# EAGLE design V2_CapTouch4Pad_ad (EAGLE 9.6.2)
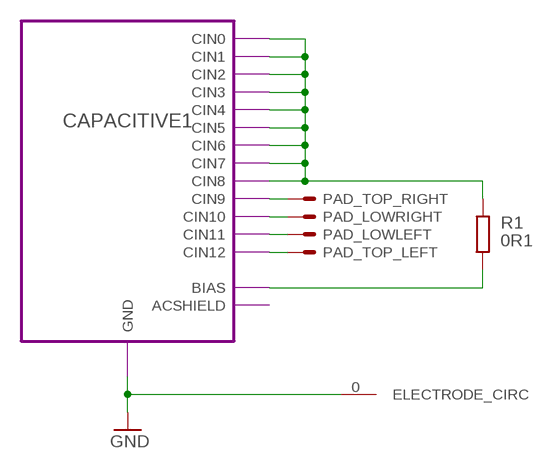
[diagram p0: schematic, sheet 1]

## Parts
PAD_LOWLEFT  TS_ELECTRODE-SLICE-BACKUP2  [TS_ELECTRODE-SLICE]
PAD_LOWRIGHT  TS_ELECTRODE-SLICE-BACKUP2  [TS_ELECTRODE-SLICE]
PAD_TOP_LEFT  TS_ELECTRODE-SLICE-BACKUP2  [TS_ELECTRODE-SLICE]
PAD_TOP_RIGHT  TS_ELECTRODE-SLICE-BACKUP2  [TS_ELECTRODE-SLICE]
R1  RL1206FR-7W0R1L  [R1206]
U$5  TS_ELECTRODE_CIRC  [TS_ELECTRODE_CIRC]

## Module instances
CAPACITIVE1 = CAPACITIVE

## Nets
GND: U$5.0(ELECTRODE_CIRC) ; port CAPACITIVE1.GND
N$1: PAD_TOP_RIGHT.PAD$1(S) ; port CAPACITIVE1.CIN9
N$2: PAD_LOWRIGHT.PAD$1(S) ; port CAPACITIVE1.CIN10
N$3: PAD_LOWLEFT.PAD$1(S) ; port CAPACITIVE1.CIN11
N$4: PAD_TOP_LEFT.PAD$1(S) ; port CAPACITIVE1.CIN12
N$5: R1.2 ; port CAPACITIVE1.CIN8 CAPACITIVE1.CIN0 CAPACITIVE1.CIN7 CAPACITIVE1.CIN6 CAPACITIVE1.CIN5 CAPACITIVE1.CIN4 CAPACITIVE1.CIN3 CAPACITIVE1.CIN2 CAPACITIVE1.CIN1
N$6: R1.1 ; port CAPACITIVE1.BIAS

## Library data of the parts
PAD_LOWLEFT PAD_LOWRIGHT PAD_TOP_LEFT PAD_TOP_RIGHT = msrm:TS_ELECTRODE-SLICE-BACKUP2
R1 = msrm:RL?FR-7W*L: SMD RESISTOR RES 0.1 OHM 1% 1/2W 1206 package: 1206 : 0.1 Ohm ___ Source: Digikey <https://www.digikey.de/products/en?keywords=311-0.1LYCT-ND> ; Datasheet <http://www.yageo.com/documents/recent/PYu-RT_1-to-0.01_RoHS_L_11.pdf>; DIGIKEY: 311-0.1LYCT-ND; RVALUE: 0R1; SPICEPREFIX: R
U$5 = msrm:TS_ELECTRODE_CIRC

## Module CAPACITIVE
Ports: ACSHIELD(pas) GND(pwr) CIN0(in) CIN1(in) CIN2(in) CIN3(in) CIN4(in) CIN5(in) CIN6(in) CIN7(in) CIN8(in) CIN9(in) CIN10(in) CIN11(in) CIN12(in) BIAS(pas)
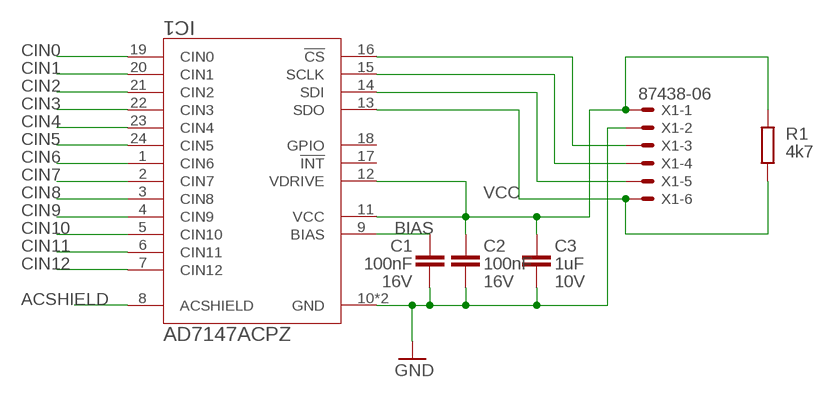
[diagram p1: schematic, module CAPACITIVE, sheet 1]

### Parts
C1  GCM155R71C104JA55  [C0402]
C2  GCM155R71C104JA55  [C0402]
C3  GCM155C7  GCM155C71A105KE38D  [C0402]
IC1  AD7147ACPZ  [CP_24_3_ADI-M]
R1  RT0402FRE074K7L  [R0402]
X1  87438-06  [87438-06]

### Nets
ACSHIELD: IC1.8(ACSHIELD)
BIAS: C1.1 IC1.9(BIAS)
CIN0: IC1.19(CIN0)
CIN1: IC1.20(CIN1)
CIN2: IC1.21(CIN2)
CIN3: IC1.22(CIN3)
CIN4: IC1.23(CIN4)
CIN5: IC1.24(CIN5)
CIN6: IC1.1(CIN6)
CIN7: IC1.2(CIN7)
CIN8: IC1.3(CIN8)
CIN9: IC1.4(CIN9)
CIN10: IC1.5(CIN10)
CIN11: IC1.6(CIN11)
CIN12: IC1.7(CIN12)
GND: C1.2 C2.2 C3.2 IC1.10(GND) IC1.HTAB(GND) X1.2
N$1: IC1.13(SDO) R1.1 X1.6
N$8: IC1.16(!CS) X1.3
N$9: IC1.15(SCLK) X1.4
N$10: IC1.14(SDI) X1.5
VCC: C2.1 C3.1 IC1.11(VCC) IC1.12(VDRIVE) R1.2 X1.1
Unconnected: IC1.17(!INT) IC1.18(GPIO)

### Library data of the parts
C1 C2 = msrm:GCM?R7*: Multilayer Ceramic Capacitors Chip Multilayer Ceramic Capacitors for Automotive –55 to 125°C Sources: Catalogue <https://www.murata.com/~/media/webrenewal/support/library/catalog/products/capacitor/mlcc/c03e.ashx?la=en-us> Part Numbering <https://search.murata.co.jp/Ceramy/image/img/A01X/partnumbering_e_02.pdf> package: C0201 : 470pF ___ Source: Digikey <https://www.digikey.de/products/en?keywords=490-17744-1-ND> ; Datasheet <https://search.murata.co.jp/Ceramy/image/img/A01X/G101/ENG/GCM033R71E471KA03-01.pdf> package: C0402 : 100nF ___ Source: Digikey <https://www.digikey.de/products/en?keywords=490-16433-1-ND> ; Datasheet <https://search.murata.co.jp/Ceramy/image/img/A01X/G101/ENG/GCM155R71C104JA55-01.pdf> 220nF ___ Source: Digikey <https://www.digikey.de/products/en?keywords=490-10671-1-ND> ; Datasheet <https://www.murata.com/-/media/webrenewal/support/library/catalog/products/capacitor/ceramiccapacitor/c03e.ashx?la=en-us&cvid=20200707014404000000> 6.8nF ___ Source: Digikey <https://www.digikey.de/products/en?keywords=490-12655-1-ND> ; Datasheet <https://search.murata.co.jp/Ceramy/image/img/A01X/G101/ENG/GCM155R71C683KA55-01.pdf> 10nF ___ Source: Digikey <https://www.digikey.de/products/en?keywords=490-6043-1-ND> ; Datasheet <https://search.murata.co.jp/Ceramy/image/img/A01X/G101/ENG/GCM155R71E103KA37-01.pdf> 22nF ___ Source: Digikey <https://www.digikey.de/products/en?keywords=490-6044-1-ND> ; Datasheet <https://search.murata.co.jp/Ceramy/image/img/A01X/G101/ENG/GCM155R71E223KA55-01.pdf> 470pF ___ Source: Digikey <https://www.digikey.de/products/en?keywords=490-4913-1-ND> ; Datasheet <https://search.murata.co.jp/Ceramy/image/img/A01X/G101/ENG/GCM155R71H471KA37-01.pdf> package: C0603 : 1µF ___ Source: Digikey <https://www.digikey.de/products/en?keywords=490-5241-1-ND> ; Datasheet <https://www.murata.com/-/media/webrenewal/support/library/catalog/products/capacitor/ceramiccapacitor/c03e.ashx?la=en-us&cvid=20200707014404000000> 470nF ___ Source: Digikey <https://www.digikey.de/products/en?keywords=490-12589-1-ND> ; Datasheet <https://search.murata.co.jp/Ceramy/image/img/A01X/G101/ENG/GCM188R71C474KA55-01.pdf> 10nF ___ Source: Digikey <https://www.digikey.de/products/en?keywords=490-4781-1-ND> ; Datasheet <https://search.murata.co.jp/Ceramy/image/img/A01X/G101/ENG/GCM188R72A103KA37-01.pdf> 22nF ___ Source: Digikey <https://www.digikey.de/products/en?keywords=490-4782-1-ND> ; Datasheet <https://www.murata.com/-/media/webrenewal/support/library/catalog/products/capacitor/ceramiccapacitor/c03e.ashx?la=en-us&cvid=20200707014404000000> package: C0805 : 10µF ___ Source: Digikey <https://www.digikey.de/products/en?keywords=490-14361-1-ND> ; Datasheet <https://search.murata.co.jp/Ceramy/image/img/A01X/G101/ENG/GCM21BR70J106KE22-01.pdf> 2.2µF ___ Source: Digikey <https://www.digikey.de/products/en?keywords=490-4786-1-ND> ; Datasheet <https://search.murata.co.jp/Ceramy/image/img/A01X/G101/ENG/GCM21BR71C225KA64-01.pdf> 470nF ___ Source: Digikey <https://www.digikey.de/products/en?keywords=490-4788-1-ND> ; Datasheet <https://search.murata.co.jp/Ceramy/image/img/A01X/G101/ENG/GCM21BR71H474KA55-01.pdf> 100nF ___ Source: Digikey <https://www.digikey.de/products/en?keywords=490-8051-1-ND> ; Datasheet <https://search.murata.co.jp/Ceramy/image/img/A01X/G101/ENG/GCM21BR72A104KA37-01.pdf> package: C0805K : 220nF ___ Source: Digikey <https://www.digikey.de/products/en?keywords=490-8306-1-ND> ; Datasheet <https://search.murata.co.jp/Ceramy/image/img/A01X/G101/ENG/GRM21AR72A224KAC5-01.pdf> package: C1206 : 10µF ___ Source: Digikey <https://www.digikey.de/products/en?keywords=490-14746-1-ND> ; Datasheet <https://search.murata.co.jp/Ceramy/image/img/A01X/G101/ENG/GCM31CR71C106KA64-01.pdf> 2.2µF ___ Source: Digikey <https://www.digikey.de/products/en?keywords=490-11169-1-ND> ; Datasheet <https://search.murata.co.jp/Ceramy/image/img/A01X/G101/ENG/GCM31CR71H225KA55-01.pdf> package: C1206 : 2220nF ___ Source: Digikey <https://www.digikey.de/products/en?keywords=490-4975-1-ND> ; Datasheet <https://search.murata.co.jp/Ceramy/image/img/A01X/G101/ENG/GCM31MR72A224KA37-01.pdf>; CAPACITANCE: 100nF; DIGIKEY: 490-16433-1-ND; TOLERANCE: ±5%; VOLTAGE: 16V
C3 = msrm:GCM?C7*: Multilayer Ceramic Capacitors Chip Multilayer Ceramic Capacitors for Automotive Sources: Catalogue <https://www.murata.com/~/media/webrenewal/support/library/catalog/products/capacitor/mlcc/c03e.ashx?la=en-us> Part Numbering <https://search.murata.co.jp/Ceramy/image/img/A01X/partnumbering_e_02.pdf> package: C0402 : 490-13409-1 ___ Source: Digikey <https://www.digikey.de/products/en?keywords=490-13409-1-ND> ; Datasheet <https://www.murata.com/-/media/webrenewal/support/library/catalog/products/capacitor/ceramiccapacitor/c03e.ashx?la=en-us&cvid=20200707014404000000> 490-14427-1 ___ Source: Digikey <https://www.digikey.de/products/en?keywords=490-14427-1-ND> ; Datasheet <https://search.murata.co.jp/Ceramy/image/img/A01X/G101/ENG/GCM155C71A474KE36-01.pdf>; CAPACITANCE: 1uF; DIGIKEY: 490-13409-1-ND; TOLERANCE: ±10%; VOLTAGE: 10V
IC1 = msrm:AD7147*: CapTouch Programmable Controller for Single-Electrode Capacitance Sensors; DESCRIPTION: Wake up on touch
R1 = msrm:RT?FRE07*L: SMD RESISTOR ± 1% Tol, Paper/PE taping reel, 50 ppm/°C, 7 inch dia. Reel Datasheet <http://www.yageo.com/documents/recent/PYu-RT_1-to-0.01_RoHS_L_11.pdf> package: 0201 : 0R ___ Source: Digikey <https://www.digikey.de/products/en?keywords=311-0.0MCT-ND> 1k ___ Source: Digikey <https://www.digikey.de/products/en?keywords=RT0201FRE071KL-ND> 10k ___ Source: Digikey <https://www.digikey.de/products/en?keywords=RT0201FRE0710KL-ND> 100 ___ Source: Digikey <https://www.digikey.de/products/en?keywords=RT0201FRE07100RL-ND> 330 ___ Source: Digikey <https://www.digikey.de/products/en?keywords=RT0201FRE07330RL-ND> package: 0402 : 0R ___ Source: Digikey <https://www.digikey.de/products/en?keywords=311-0.0LRCT-ND> 1k ___ Source: Digikey <https://www.digikey.de/products/en?keywords=%20YAG1234CT-ND> 2k2 ___ Source: Digikey <https://www.digikey.de/products/en?keywords=RT0402FRE072K2L-ND> 2k ___ Source: Digikey <https://www.digikey.de/products/en?keywords=YAG3345CT-ND> 4k7 ___ Source: Digikey <https://www.digikey.de/products/en?keywords=YAG3347CT-ND%20> 10k ___ Source: Digikey <https://www.digikey.de/products/en?keywords=YAG1233CT-ND> 12k1 ___ Source: Digikey <https://www.digikey.de/products/en?keywords=RT0402FRE0712K1L-ND> 49R9 ___ Source: Digikey <https://www.digikey.de/products/en?keywords=YAG3346CT-ND> 56k ___ Source: Digikey <https://www.digikey.de/products/en?keywords=RT0402FRE0756K2L-ND> 100k ___ Source: Digikey <https://www.digikey.de/products/en?keywords=YAG2307CT-ND> 100 ___ Source: Digikey <https://www.digikey.de/products/en?keywords=YAG3342CT-ND> 150 ___ Source: Digikey <https://www.digikey.de/product-detail/en/yageo/RT0402FRE07150RL/13-RT0402FRE07150RLCT-ND/12705162> 300 ___ Source: Digikey <https://www.digikey.de/products/en?keywords=RT0402FRE07300RL-ND> package: 0603 : 0R ___ Source: Digikey <https://www.digikey.de/products/en?keywords=311-0.0HRCT-ND> 1k ___ Source: Digikey <https://www.digikey.de/products/en?keywords=YAG2323CT-ND> 10k ___ Source: Digikey <https://www.digikey.de/products/en?keywords=YAG2321CT-ND> 100k ___ Source: Digikey <https://www.digikey.de/products/en?keywords=YAG2319CT-ND> 100 ___ Source: Digikey <https://www.digikey.de/products/en?keywords=YAG2320CT-ND> 300 ___ Source: Digikey <https://www.digikey.de/products/en?keywords=RT0603FRE07300RL-ND> 330 ___ Source: Digikey <https://www.digikey.de/products/en?keywords=YAG5957CT-ND>; DIGIKEY: YAG3347CT-ND; RVALUE: 4k7; SPICEPREFIX: R
X1 = con-molex:87438-06: Wire-to-Board 1.50mm (.059") Pitch Header - Right Angle, SMT, Shrouded Source: http://www.molex.com/product/micro/87438.html; MF: MOLEX; MPN: 87438-0643; OC_FARNELL: 1756938; OC_NEWARK: 88K3155

## Net classes
0 default: width 0.2 mm

## Board
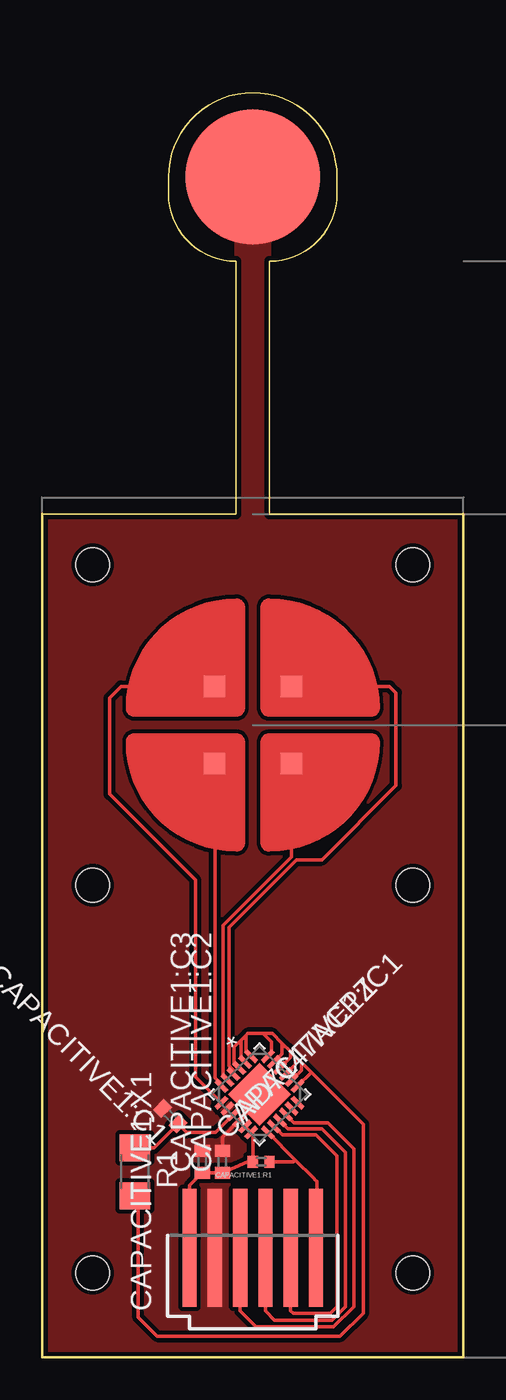
[diagram p2: board, top side]
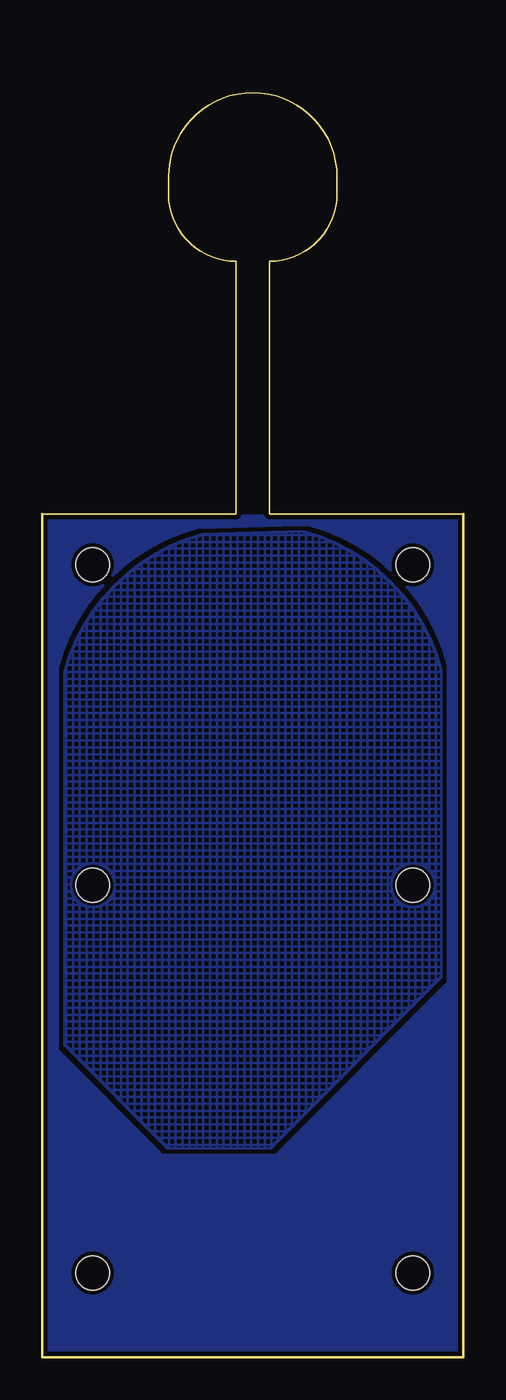
[diagram p3: board, bottom side, seen from below]

Size 25 x 75 mm. Coordinates in mm from the lower left corner, seen from the top.
Outline: 0,0 25,0 25,50 13.5,50 13.5,65 arc90 17.5,69 17.5,70 arc90 12.5,75 arc90 7.5,70 7.5,69 arc90 11.5,65 11.5,50 0,50 0,0
Copper layers (1*16): Top 0.018mm / dielectric 1.55mm / Bottom 0.018mm
Design rules "Multi-CB_2L_100µm-Tracks_OL35µm": minimum track width 0.1mm, minimum drill 0.2mm, track to track 0.1mm, track to pad 0.1mm, pad to pad 0.1mm, via to via 0.1mm, smd to smd 0mil, copper to edge 0.2mm, drill to drill 0.2mm, minimum pad ring 0.125mm, minimum via ring 0.1mm, stop-mask expansion 2mil, vias tented up to drill 0.45mm, thermal gap 0.2mm
Holes 2 mm at 3,47 22,47 3,5 22,5 3,28 22,28

### Footprints (pad centres in the part's own frame; a part is rotated, then mirrored left to right if it is on the bottom)
C0402 = smd 0.7 x 0.9: 1 -0.65,0; 2 0.65,0
CP_24_3_ADI-M = smd 0.275 x 0.9: 1 1.25,1.95; 2 0.75,1.95; 3 0.25,1.95; 4 -0.25,1.95; 5 -0.75,1.95; 6 -1.25,1.95; 13 -1.25,-1.95; 14 -0.75,-1.95; 15 -0.25,-1.95; 16 0.25,-1.95; 17 0.75,-1.95; 18 1.25,-1.95 | smd 0.9 x 0.275: 7 -1.95,1.25; 8 -1.95,0.75; 9 -1.95,0.25; 10 -1.95,-0.25; 11 -1.95,-0.75; 12 -1.95,-1.25; 19 1.95,-1.25; 20 1.95,-0.75; 21 1.95,-0.25; 22 1.95,0.25; 23 1.95,0.75; 24 1.95,1.25 | smd 2.65 x 2.65: HTAB 0,0
R0402 = smd 0.6 x 0.7: 1 -0.5,0; 2 0.5,0
87438-06 = smd 7 x 0.85: 1 0,3.75; 2 0,2.25; 3 0,0.75; 4 0,-0.75; 5 0,-2.25; 6 0,-3.75
TS_ELECTRODE-SLICE = smd 1.27 x 1.27: PAD$1 -2.286,2.286
R1206 = smd 1.6 x 1.803: 1 -1.422,0; 2 1.422,0
TS_ELECTRODE_CIRC = smd 8 x 8: 0 0,0

### Placement (x,y rotation side)
CAPACITIVE1:C1  GCM155R71C104JA55  [C0402]  7.6,14.3 135 top
CAPACITIVE1:C2  GCM155R71C104JA55  [C0402]  10.7,11.6 90 top
CAPACITIVE1:C3  GCM155C7  [C0402]  9.5,11.6 90 top
CAPACITIVE1:IC1  AD7147ACPZ  [CP_24_3_ADI-M]  12.9,15.6 45 top
CAPACITIVE1:R1  RT0402FRE074K7L  [R0402]  13,11.6 180 top
CAPACITIVE1:X1  87438-06  [87438-06]  12.5,6.5 90 top
PAD_LOWLEFT  12.5,37.5 90 top
PAD_LOWRIGHT  12.5,37.5 180 top
PAD_TOP_LEFT  12.5,37.5 0 top
PAD_TOP_RIGHT  12.5,37.5 270 top
R1  5.5,11 270 top
U$5  12.5,70 0 top

### Tracks (layer width: path | path; a pad name or v marks a point on that pad's centre or on a via)
CAPACITIVE1:ACSHIELD
  pour Top (hatched): 11.6,12.2 1.3,22.5 1.3,40.8 arc-60 9.03,48.3 15.98,48.3 arc-60 23.6,40.7 23.6,18.4 17.4,12.2
  pour Bottom (hatched): 11.4,12.4 1.3,22.5 1.3,40.8 arc-60 9.51,49.01 15.47,48.83 arc-60 23.7,40.6 23.7,18.5 17.6,12.4
CAPACITIVE1:N$1
  Top 0.2: CAPACITIVE1:X1.6 16.3,6.55 16.3,7 16.3,8.1 16.3,10.43 16.2,10.53 16.12,10.62 15.02,11.72 | CAPACITIVE1:IC1.13 15.02,11.72 | CAPACITIVE1:R1.1 14.9,11.6 15.02,11.72
CAPACITIVE1:N$8
  Top 0.2: CAPACITIVE1:X1.3 11.75,2.75 12.7,1.8 17.3,1.8 18.5,3 18.5,12.35 16.96,13.9 15,13.9 14.96,13.9 CAPACITIVE1:IC1.16
CAPACITIVE1:N$9
  Top 0.2: CAPACITIVE1:X1.4 13.25,2.75 13.8,2.2 17.2,2.2 18,3 18,12.15 16.6,13.54 15,13.54 14.6,13.54 CAPACITIVE1:IC1.15
CAPACITIVE1:N$10
  Top 0.2: CAPACITIVE1:X1.5 14.75,2.75 14.9,2.6 17.1,2.6 17.5,3 17.5,11.94 16.25,13.19 14.25,13.19 CAPACITIVE1:IC1.14
CAPACITIVE1:VCC
  Top 0.2: CAPACITIVE1:IC1.12 CAPACITIVE1:IC1.11 | CAPACITIVE1:X1.1 8.75,10.2 CAPACITIVE1:C3.1 CAPACITIVE1:C2.1 12.17,11.6 CAPACITIVE1:R1.2 12.5,13.24 CAPACITIVE1:IC1.12 | CAPACITIVE1:IC1.12
GND
  Top 0.2: CAPACITIVE1:IC1.HTAB 12.9,15.25 CAPACITIVE1:IC1.10 10.7,13.05 CAPACITIVE1:C2.2
  pour Top (isolate 0.254, rank 6, no thermals): 0,0 0,50 11.5,50 11.5,67 13.5,67 13.5,50 25,50 25,0
  pour Bottom (isolate 0.254, rank 6): 0,0 0,49.9 25,49.9 25,0
N$1
  Top 0.2: CAPACITIVE1:IC1.4 11.34,17.03 11.08,17.29 11.08,25.48 15.1,29.5 16.6,29.5 21,33.9 21,39.4 20.61,39.79 PAD_TOP_RIGHT.PAD$1
N$2
  Top 0.2: CAPACITIVE1:IC1.5 10.99,16.48 10.73,16.74 10.73,25.63 14.79,29.69 PAD_LOWRIGHT.PAD$1
N$3
  Top 0.2: CAPACITIVE1:IC1.6 10.64,16.23 10.28,16.59 10.28,35.15 PAD_LOWLEFT.PAD$1
N$4
  Top 0.2: CAPACITIVE1:IC1.7 9.1,16.64 9.1,28.3 4,33.4 4,39.1 4.69,39.79 PAD_TOP_LEFT.PAD$1
N$5
  Top 0.2: CAPACITIVE1:IC1.19 15.97,16.9 | 15.97,16.9 19.05,13.82 19.05,2.63 17.67,1.25 6.83,1.25 5.7,2.38 5.7,9.38 R1.2 | 15.97,16.9 15.38,17.48 | 15.38,17.48 15.03,17.83 | 15.03,17.83 14.73,18.13 | 14.73,18.13 14.23,18.63 | 14.23,18.63 13.67,19.2 13.1,19.2 | 13.1,19.2 12.2,19.2 12.1,19.1 | 12.1,19.1 11.8,18.8 | 11.8,18.8 11.4,18.4 11.4,17.45 CAPACITIVE1:IC1.3 | CAPACITIVE1:IC1.2 11.8,17.76 11.8,18.8 | CAPACITIVE1:IC1.1 12.1,18.17 12.1,19.1 | CAPACITIVE1:IC1.24 13.6,18.07 13.6,18.7 13.1,19.2 | CAPACITIVE1:IC1.23 14.23,18 14.23,18.63 | CAPACITIVE1:IC1.22 14.73,17.79 14.73,18.13 | CAPACITIVE1:IC1.21 15.03,17.38 15.03,17.83 | CAPACITIVE1:IC1.20 15.38,17.02 15.38,17.48
N$6
  Top 0.2: R1.1 6.64,12.42 CAPACITIVE1:C1.1 8.56,13.34 10.29,13.34 CAPACITIVE1:IC1.9